# Altium schematic sheet WR_OSC.SchDoc: SVPXFMC Carrier 3U
size A4; CheckedBy: \; Author: T.Przywozki; CompanyName: ISE; DrawnBy: T.Przywozki; Organization: WUT ISE; Address1: Warsaw University of Technology; Address2: Nowowiejska 15/19 00-665 Warsaw; Revision: 1.0.; SheetNumber: 15; SheetTotal: 20; Project: SVPXFMC Carrier 3U; ModifiedBy: -; CheckedDate: -; Title2: WR Oscillators; DivGrp: ISE; Designer: T.Przywozki
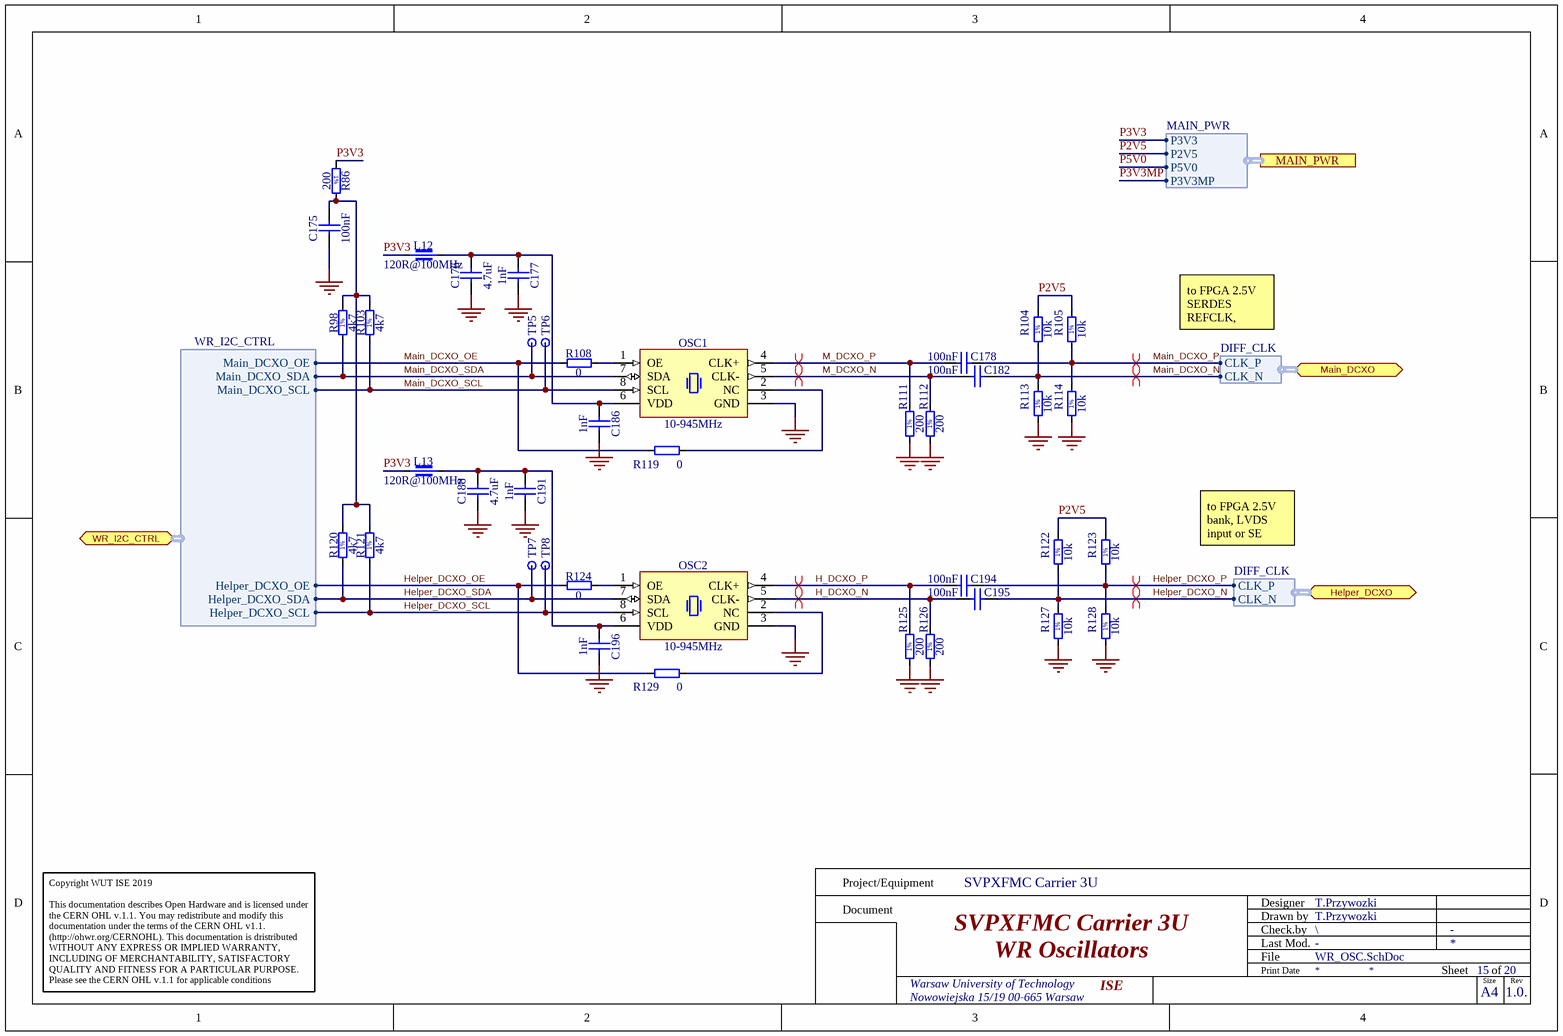
[diagram p0: WR_OSC.SchDoc]

## Parts
C175  100nF  [CAPC0603X33N]
C176  4.7uF  [CAPC1608X90N]
C177  1nF  [CAPC0603X33N]
C178  100nF  [CAPC1005X55N]
C182  100nF  [CAPC1005X55N]
C186  1nF  [CAPC0603X33N]
C188  4.7uF  [CAPC1608X90N]
C191  1nF  [CAPC0603X33N]
C194  100nF  [CAPC1005X55N]
C195  100nF  [CAPC1005X55N]
C196  1nF  [CAPC0603X33N]
L12  120R@100MHz  [INDC1608X95N]
L13  120R@100MHz  [INDC1608X95N]
OSC1  10-945MHz  [OSC_SILICON-LAB_SI570]
OSC2  10-945MHz  [OSC_SILICON-LAB_SI570]
R86  200  [RESC1005X40N]
R98  4k7  [RESC1005X40N]
R103  4k7  [RESC1005X40N]
R104  10k  [RESC1005X40N]
R105  10k  [RESC1005X40N]
R108  0  [RESC1005X40N]
R111  200  [RESC1005X40N]
R112  200  [RESC1005X40N]
R113  10k  [RESC1005X40N]
R114  10k  [RESC1005X40N]
R119  0  [RESC1005X40N]
R120  4k7  [RESC1005X40N]
R121  4k7  [RESC1005X40N]
R122  10k  [RESC1005X40N]
R123  10k  [RESC1005X40N]
R124  0  [RESC1005X40N]
R125  200  [RESC1005X40N]
R126  200  [RESC1005X40N]
R127  10k  [RESC1005X40N]
R128  10k  [RESC1005X40N]
R129  0  [RESC1005X40N]
TP5  Test Point  [TPS127]  (value not drawn)
TP6  Test Point  [TPS127]  (value not drawn)
TP7  Test Point  [TPS127]  (value not drawn)
TP8  Test Point  [TPS127]  (value not drawn)

## Ports
Helper_DCXO (bidir, harness DIFF_CLK), Main_DCXO (bidir, harness DIFF_CLK), MAIN_PWR (harness MAIN_PWR), WR_I2C_CTRL (bidir, harness WR_I2C_CTRL)

## Harnesses
WR_I2C_CTRL: Main_DCXO_OE, Main_DCXO_SDA, Main_DCXO_SCL, Helper_DCXO_OE, Helper_DCXO_SDA, Helper_DCXO_SCL
DIFF_CLK: CLK_N, CLK_P
MAIN_PWR: P3V3, P2V5, P5V0, P3V3MP

## Nets
GND: C175.1 C176.1 C177.1 C186.1 C188.1 C191.1 C196.1 OSC1.3(GND) OSC2.3(GND) R111.1 R112.1 R113.1 R114.1 R125.1 R126.1 R127.1 R128.1
H_DCXO_N: C195.1 OSC2.5(CLK-) R126.2
H_DCXO_P: C194.1 OSC2.4(CLK+) R125.2
Helper_DCXO_N: C195.2 R122.1 R127.2 ; port Helper_DCXO.CLK_N
Helper_DCXO_OE: R124.1 R129.1 ; port WR_I2C_CTRL.Helper_DCXO_OE
Helper_DCXO_P: C194.2 R123.1 R128.2 ; port Helper_DCXO.CLK_P
Helper_DCXO_SCL: OSC2.8(SCL) R121.1 TP8.1 ; port WR_I2C_CTRL.Helper_DCXO_SCL
Helper_DCXO_SDA: OSC2.7(SDA) R120.1 TP7.1 ; port WR_I2C_CTRL.Helper_DCXO_SDA
M_DCXO_N: C182.1 OSC1.5(CLK-) R112.2
M_DCXO_P: C178.1 OSC1.4(CLK+) R111.2
Main_DCXO_N: C182.2 R104.1 R113.2 ; port Main_DCXO.CLK_N
Main_DCXO_OE: R108.1 R119.1 ; port WR_I2C_CTRL.Main_DCXO_OE
Main_DCXO_P: C178.2 R105.1 R114.2 ; port Main_DCXO.CLK_P
Main_DCXO_SCL: OSC1.8(SCL) R103.1 TP6.1 ; port WR_I2C_CTRL.Main_DCXO_SCL
Main_DCXO_SDA: OSC1.7(SDA) R98.1 TP5.1 ; port WR_I2C_CTRL.Main_DCXO_SDA
P2V5: R104.2 R105.2 R122.2 R123.2 ; port MAIN_PWR.P2V5
P3V3: L12.1 L13.1 R86.1 ; port MAIN_PWR.P3V3
P3V3MP: port MAIN_PWR.P3V3MP
P5V0: port MAIN_PWR.P5V0
NetC175_2: C175.2 R86.2 R98.2 R103.2 R120.2 R121.2
NetC176_2: C176.2 C177.2 C186.2 L12.2 OSC1.6(VDD)
NetC188_2: C188.2 C191.2 C196.2 L13.2 OSC2.6(VDD)
NetOSC1_1: OSC1.1(OE) R108.2
NetOSC1_2: OSC1.2(NC) R119.2
NetOSC2_1: OSC2.1(OE) R124.2
NetOSC2_2: OSC2.2(NC) R129.2

## Layout directives
differential pair: H_DCXO_N, H_DCXO_P, Helper_DCXO_N, Helper_DCXO_P, M_DCXO_N, M_DCXO_P, Main_DCXO_N, Main_DCXO_P

## Notes on the sheet
- to FPGA 2.5V SERDES REFCLK, LVDS input
- to FPGA 2.5V bank, LVDS input or SE mode
- Project/Equipment
- Document
- Designer
- Drawn by
- Check.by
- Copyright WUT ISE 2019
  This documentation describes Open Hardware and is licensed under the CERN OHL v.1.1. You may redistribute and modify this documentation under the terms of the CERN OHL v1.1.
  (http://ohwr.org/CERNOHL). This documentation is dristributed WITHOUT ANY EXPRESS OR IMPLIED WARRANTY, INCLUDING OF MERCHANTABILITY, SATISFACTORY QUALITY AND FITNESS FOR A PARTICULAR PURPOSE. Please see the CERN OHL v.1.1 for applicable conditions
- File
- Last Mod.
- Print Date
- Sheet
- Size
- A4
- of
- Rev
- (in symbol R0402_4K7_1%_0.0625W_100PPM) 1%
- (in symbol R0402_10K_1%_0.0625W_100PPM) 1%
- (in symbol R0402_200R_1%_0.0625W_100PPM) 1%

## Library data of the parts
C175 = CC0201_100NF_6.3V_10%_X5R: Non-polarised capacitor; Manufacturer: GENERIC; Part Description: SMD Multilayer Chip Ceramic Capacitor; Manufacturer1 Part Number: 02016D104KAT2A; Tolerance: ±10%; Voltage: 6.3V; TC: X5R; Manufacturer Part Number: CC0201_100NF_6.3V_10%_X5R; Part Number: CC0201_100NF_6.3V_10%_X5R; Value: 100nF; Component Kind: Standard; Component Type: Standard; Pin Count: 2; Status: Not Recommended; Case: 0201; Mounted: Yes; Socket: No; SMD: Yes; Sense: No; Manufacturer1 Example: AVX; Manufacturer1 ComponentHeight: 0.33mm; HelpURL: \\cern.ch\dfs\Applications\Altium\Datasheets\CC0201_X5R_AVX.pdf; Author: CERN DEM JLC; CreateDate: 03.12.2007; LatestRevisionDate: 03.12.2007
C176 C188 = CC0603_4.7UF_25V_10%_X5R: Non-polarised capacitor; Manufacturer: GENERIC; Part Description: SMD Multilayer Chip Ceramic Capacitor; Manufacturer1 Part Number: GRM188R61E475KE11D; Tolerance: ±10%; Voltage: 25V; TC: X5R; Manufacturer Part Number: CC0603_4.7UF_25V_10%_X5R; Part Number: CC0603_4.7UF_25V_10%_X5R; Value: 4.7uF; Component Kind: Standard; Component Type: Standard; Pin Count: 2; Status: None; Case: 0603; Mounted: Yes; Socket: No; SMD: Yes; Sense: No; Manufacturer1 Example: MURATA; Manufacturer1 ComponentHeight: 0.95mm; HelpURL: \\cern.ch\dfs\Applications\Altium\Datasheets\CC0603_MURATA_GRM188R61E475KE11D.pdf; Author: CERN DEM JLC; CreateDate: 10.11.2014; LatestRevisionDate: 10.11.2014
C177 C186 C191 C196 = CC0201_1NF_16V_10%_X5R: Non-polarised capacitor; Manufacturer: GENERIC; Part Description: SMD Multilayer Chip Ceramic Capacitor; Manufacturer1 Part Number: 0201YD102KAT2A; Tolerance: ±10%; Voltage: 16V; TC: X5R; Manufacturer Part Number: CC0201_1NF_16V_10%_X5R; Part Number: CC0201_1NF_16V_10%_X5R; Value: 1nF; Component Kind: Standard; Component Type: Standard; Pin Count: 2; Status: Not Recommended; Case: 0201; Mounted: Yes; Socket: No; SMD: Yes; Sense: No; Manufacturer1 Example: AVX; Manufacturer1 ComponentHeight: 0.33mm; HelpURL: \\cern.ch\dfs\Applications\Altium\Datasheets\CC0201_X5R_AVX.pdf; Author: CERN DEM JLC; CreateDate: 03.12.2007; LatestRevisionDate: 03.12.2007
C178 C182 C194 C195 = CC0402_100NF_16V_10%_X5R: Non-polarised capacitor; Manufacturer: GENERIC; Manufacturer1 Part Number: GRM155R61C104KA88D; Part Description: SMD Multilayer Chip Ceramic Capacitor; TC: X5R; Tolerance: ±10%; Voltage: 16V; Case: 0402; Manufacturer Part Number: CC0402_100NF_16V_10%_X5R; Manufacturer1 Example: MURATA; Part Number: CC0402_100NF_16V_10%_X5R; Pin Count: 2; SMD: Yes; Status: None; Value: 100nF; Component Kind: Standard; Component Type: Standard; Mounted: Yes; Socket: No; Sense: No; Manufacturer1 ComponentHeight: 0.55mm; HelpURL: \\cern.ch\dfs\Applications\Altium\Datasheets\CC0402_X5R_MURATA_GRM.pdf; Author: CERN DEM JLC; CreateDate: 10.12.2013; LatestRevisionDate: 10.12.2013
L12 L13 = IND0603_MURATA_BLM18PG121SN1D: Manufacturer: MURATA; Part Description: SMD EMIFIL Chip Ferrite Bead; Power: 2A; Resistance: 0.05R; Manufacturer Part Number: BLM18PG121SN1D; Part Number: IND0603_MURATA_BLM18PG121SN1D; Value: 120R@100MHz; Component Kind: Standard; Component Type: Standard; Pin Count: 2; Status: None; Case: 0603; Mounted: Yes; Socket: No; SMD: Yes; Sense: No; ComponentHeight: 0.95mm; HelpURL: \\cern.ch\dfs\Applications\Altium\Datasheets\IND0603_MURATA_BLM18P.pdf; Author: CERN DEM BC; CreateDate: 27.07.2015; LatestRevisionDate: 25.10.2018
OSC1 OSC2 = 570ACA001527DGR: Ultra Low Jitter I2C Programmable XO (95 fs), 0.2 to 250MHz; Manufacturer: Silabs; Part Description: 10 MHZ TO 945 MHZ I2C PROGRAMMABLE XO/VCXO; Part Name: OSC_10-945MHZ_SILICON-LAB_Si570ACA001527DGR; Part Number: OSC_10_945M_SILICON-LAB_570ACA001527DGR; Tolerance: 20ppm; Voltage: 3V3; Case: OSC_SILICON-LAB_SI570; Cell Name: OSC_SILICON-LAB_SI570; Device: 570ACA001527DGR; Manufacturer Part Number: 570ACA001527DGR; Value: 10-945MHz
R86 R111 R112 R125 R126 = R0402_200R_1%_0.0625W_100PPM: Resistor - 1%; Manufacturer: GENERIC; Part Description: General Purpose Thick Film Chip Resistor; Manufacturer1 Part Number: 232270672001L; TC: ±100ppm/°C; PressFit: No; Manufacturer Part Number: R0402_200R_1%_0.0625W_100PPM; Part Number: R0402_200R_1%_0.0625W_100PPM; Tolerance: ±1%; Value: 200; Component Kind: Standard; Component Type: Standard; Pin Count: 2; Status: Not Recommended; Power: 0.0625W; Case: 0402; Mounted: Yes; Sense: No; Socket: No; SMD: Yes; Manufacturer1 Example: YAGEO PHYCOMP; Manufacturer1 ComponentHeight: 0.4mm; HelpURL: \\cern.ch\dfs\Applications\Altium\Datasheets\R0402_Phycomp_RC0402.pdf; Author: CERN DEM JLC; CreateDate: 03.12.2007; LatestRevisionDate: 17.10.2012
R98 R103 R120 R121 = R0402_4K7_1%_0.0625W_100PPM: Resistor - 1%; Manufacturer: GENERIC; Part Description: General Purpose Thick Film Chip Resistor; Manufacturer1 Part Number: 232270674702L; TC: ±100ppm/°C; PressFit: No; Manufacturer Part Number: R0402_4K7_1%_0.0625W_100PPM; Part Number: R0402_4K7_1%_0.0625W_100PPM; Tolerance: ±1%; Value: 4k7; Component Kind: Standard; Component Type: Standard; Pin Count: 2; Status: Not Recommended; Power: 0.0625W; Case: 0402; Mounted: Yes; Sense: No; Socket: No; SMD: Yes; Manufacturer1 Example: YAGEO PHYCOMP; Manufacturer1 ComponentHeight: 0.4mm; HelpURL: \\cern.ch\dfs\Applications\Altium\Datasheets\R0402_Phycomp_RC0402.pdf; Author: CERN DEM JLC; CreateDate: 03.12.2007; LatestRevisionDate: 17.10.2012
R104 R105 R113 R114 R122 R123 R127 R128 = R0402_10K_1%_0.0625W_100PPM: Resistor - 1%; Manufacturer: GENERIC; Part Description: General Purpose Thick Film Chip Resistor; Manufacturer1 Part Number: 232270671003L; TC: ±100ppm/°C; PressFit: No; Manufacturer Part Number: R0402_10K_1%_0.0625W_100PPM; Part Number: R0402_10K_1%_0.0625W_100PPM; Tolerance: ±1%; Value: 10k; Component Kind: Standard; Component Type: Standard; Pin Count: 2; Status: Not Recommended; Power: 0.0625W; Case: 0402; Mounted: Yes; Sense: No; Socket: No; SMD: Yes; Manufacturer1 Example: YAGEO PHYCOMP; Manufacturer1 ComponentHeight: 0.4mm; HelpURL: \\cern.ch\dfs\Applications\Altium\Datasheets\R0402_Phycomp_RC0402.pdf; Author: CERN DEM JLC; CreateDate: 03/12/2007; LatestRevisionDate: 17/10/2012
R108 R119 R124 R129 = R0402_0R_JUMPER: Resistor; Manufacturer: GENERIC; Part Description: 1A (0.05R Max DC Resistance) Zero Ohm Jumper; Manufacturer1 Part Number: 232270591001L; PressFit: No; Manufacturer Part Number: R0402_0R_JUMPER; Part Number: R0402_0R_JUMPER; Value: 0; Component Kind: Standard; Component Type: Standard; Pin Count: 2; Status: Not Recommended; Case: 0402; Mounted: Yes; Sense: No; Socket: No; SMD: Yes; Manufacturer1 Example: YAGEO PHYCOMP; Manufacturer1 ComponentHeight: 0.4mm; HelpURL: \\cern.ch\dfs\Applications\Altium\Datasheets\R0402_Phycomp_RC0402.pdf; Author: CERN DEM JLC; CreateDate: 03.12.2007; LatestRevisionDate: 17.10.2012
TP5-TP8 = SMD_PAD_1.27X1.27MM: Part Description: 1.27mm x 1.27mm PCB Copper Area (SMD Test Point); Mounted: No; Part Number: SMD_PAD_1.27X1.27MM; Component Kind: Standard (No BOM); Component Type: Standard (No BOM); Pin Count: 1; Family: Test Point; Socket: No; SMD: Yes; Sense: No; Status: None; ComponentHeight: 0mm; HelpURL: Undefined; Author: CERN DEM JLC; CreateDate: 12.01.2008; LatestRevisionDate: 12.01.2008; PackageDescription: 1.27mm x 1.27mm PCB Copper Area (SMD Test Point)